# Altium schematic sheet Sheet1.SchDoc
size A4; SheetNumber: 1; SheetTotal: 1
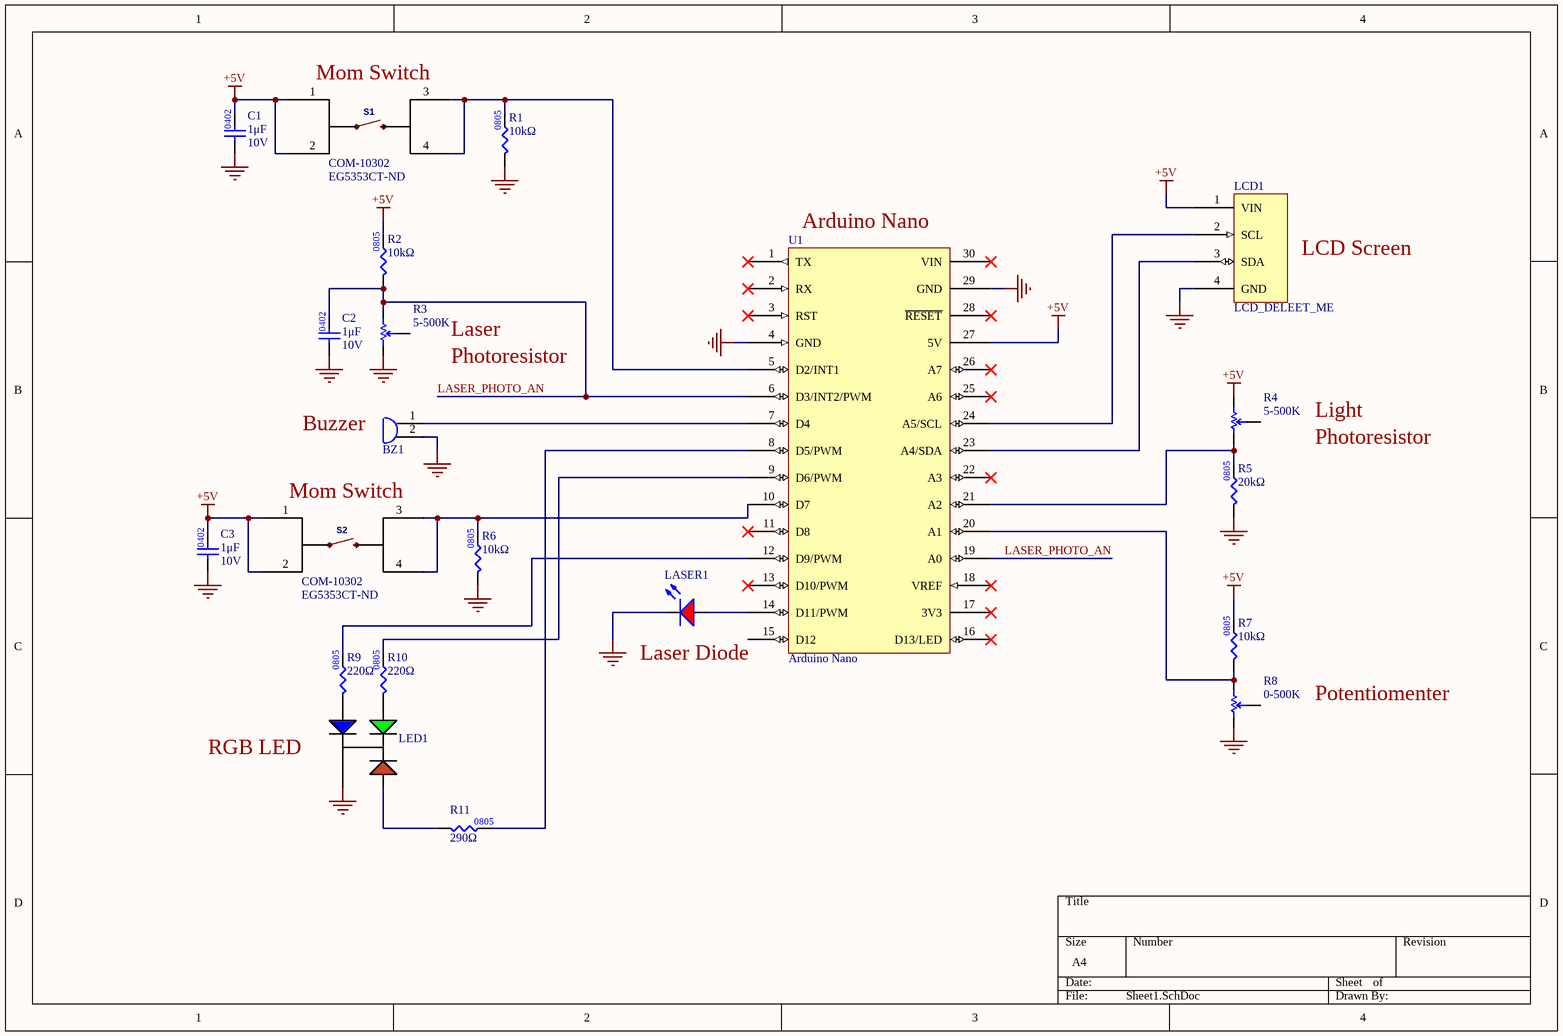
[diagram p0: Sheet1.SchDoc]

## Parts
BZ1  CMI-1275C-050  [CMI1275C050]  (value not drawn)
C1  Capacitance: 1μF  Rated DC Voltage (URdc): 10V  [CAP0402]  (hidden comment: CAP_1UF_10V_0402_X5R)
C2  Capacitance: 1μF  Rated DC Voltage (URdc): 10V  [CAP0402]  (hidden comment: CAP_1UF_10V_0402_X5R)
C3  Capacitance: 1μF  Rated DC Voltage (URdc): 10V  [CAP0402]  (hidden comment: CAP_1UF_10V_0402_X5R)
LASER1  LED_RED  [LED_0805_RED]  (value not drawn)
LCD1  LCD_DELEET_ME
LED1  LED_RGB_CA  [LED_RGB]  (value not drawn)
R1  value 10kΩ  [RES0805]  (hidden comment: RES_10kΩ_0805_5%)
R2  value 10kΩ  [RES0805]  (hidden comment: RES_10kΩ_0805_5%)
R3  value 5-500K  [3362P-1-502LF]  (hidden comment: POT_5K)
R4  value 5-500K  [3362P-1-502LF]  (hidden comment: POT_5K)
R5  value 20kΩ  [RES0805]  (hidden comment: RES_20kΩ_0805_1%)
R6  value 10kΩ  [RES0805]  (hidden comment: RES_10kΩ_0805_5%)
R7  value 10kΩ  [RES0805]  (hidden comment: RES_10kΩ_0805_5%)
R8  value 0-500K  [3362P-1-502LF]  (hidden comment: POT_5K)
R9  value 220Ω  [RES0805]  (hidden comment: RES_220Ω_0805_5%)
R10  value 220Ω  [RES0805]  (hidden comment: RES_220Ω_0805_5%)
R11  value 290Ω  [RES0805]  (hidden comment: RES_220Ω_0805_5%)
S1  Manufacturer Part Number 1: COM-10302  Supplier Part Number 2: EG5353CT-ND  [TACTILE_SWITCH_PTH_12MM]  (hidden comment: SW_MOMENTARY_PUSHBUTTON)
S2  Manufacturer Part Number 1: COM-10302  Supplier Part Number 2: EG5353CT-ND  [TACTILE_SWITCH_PTH_12MM]  (hidden comment: SW_MOMENTARY_PUSHBUTTON)
U1  Arduino Nano

## Nets
+5V: C1.2 C3.2 LCD1.1(VIN) R2.2 R4.2 R7.2 S1.1 S1.2 S2.1 S2.2 U1.27(5V)
GND: BZ1.2 C1.1 C2.1 C3.1 LASER1.2(K) LCD1.4(GND) LED1.4(COMMON_ANODE) R1.1 R3.1 R5.1 R6.1 R8.1 U1.4(GND) U1.29(GND)
LASER_PHOTO_AN: C2.2 R2.1 R3.2 U1.6(D3/INT2/PWM) U1.19(A0)
NetBZ1_1: BZ1.1 U1.7(D4)
NetLASER1_1: LASER1.1(A) U1.14(D11/PWM)
NetLCD1_2: LCD1.2(SCL) U1.24(A5/SCL)
NetLCD1_3: LCD1.3(SDA) U1.23(A4/SDA)
NetLED1_1: LED1.1(CATHODE_(RED)) R11.1
NetLED1_2: LED1.2(CATHODE_(GREEN)) R10.1
NetLED1_3: LED1.3(CATHODE_(BLUE)) R9.1
NetR1_2: R1.2 S1.3 S1.4 U1.5(D2/INT1)
NetR4_1: R4.1 R5.2 U1.21(A2)
NetR6_2: R6.2 S2.3 S2.4 U1.10(D7)
NetR7_1: R7.1 R8.2 U1.20(A1)
NetR9_2: R9.2 U1.12(D9/PWM)
NetR10_2: R10.2 U1.9(D6/PWM)
NetR11_2: R11.2 U1.8(D5/PWM)

Not connected (* = marked no-connect by the designer): R3 3; R4 3; R8 3; U1 1(TX)* 2(RX)* 3(RST)* 11(D8)* 13(D10/PWM)* 15(D12) 16(D13/LED)* 17(3V3)* 18(VREF)* 22(A3)* 25(A6)* 26(A7)* 28(~{RESET})* 30(VIN)*

## Notes on the sheet
- (near S1) Mom Switch
- (near U1) Arduino Nano
- LCD Screen
- Photoresistor
- Laser
- (near BZ1) Buzzer
- Light
- (near S2) Mom Switch
- Laser Diode
- Potentiomenter
- RGB LED

## Library data of the parts
BZ1 = CMI-1275C-050: Buzzer; Manufacturer 1: CUI Inc.; Datasheet Link: https://componentsearchengine.com/Datasheets/1/CMI-1275C-050.pdf; Height: 8mm; Manufacturer Part Number 1: CMI-1275C-050; Mouser Part Number: 490-CMI-1275C-050; Mouser Price/Stock: https://www.mouser.co.uk/ProductDetail/CUI-Devices/CMI-1275C-050?qs=qCxwlXJ4fnyWvfqXc%252BNqAA%3D%3D; Arrow Part Number: CMI-1275C-050; Arrow Price/Stock: https://www.arrow.com/en/products/cmi-1275c-050/cui-inc; Supplier 1: Digi-Key; Supplier Part Number 1: 668-1456-ND
C1-C3 = CAP_1UF_10V_0402_X5R: CAP CER 1UF 10V X5R 0402; Manufacturer: Kyocera AVX; Manufacturer Part Number: 0402ZD105MAT2A; Supplier 1: Digi-Key; Supplier Part Number 1: 478-5768-1-ND; Mounting Type: Surface Mount; Package: 0402; Temperature Characteristics Code: X5R; ComponentLink7URL: https://datasheet.ciiva.com/11531/cx5r-11531784.pdf?src-supplier=Avnet; ComponentLink7Description: https://datasheet.ciiva.com/11531/cx5r-11531784.pdf?src-supplier=Avnet
LASER1 = LED_RED: LED RED DIFFUSED 0805 SMD; Manufacturer 1: OSRAM; Manufacturer Part Number 1: LS R976-NR-1; Package/Footprint: 0805; Forward Voltage Drop: 2V; Supplier Part Number 1: 475-1278-1-ND; Supplier 1: Digi-Key; Mounting Type: SMD
LED1 = LED_RGB_CA: LED RGB DIFFUSED 4PLCC SMD; Manufacturer 1: Broadcom; Manufacturer Part Number 1: ASMB-MTB1-0A3A2; Color: Blue,Green,Red; Lens Color: White; Viewing Angle: 115°; Lens Style: Round; Luminous Intensity: 350mcd; Dominant Wavelength: 470nm; Forward Voltage: 3.1V; Test Current: 20mA; Package/Footprint: 4-PLCC; Supplier 1: Digi-Key; Mounting Type: SMD; Number of Pins: 4; Lens Transparency: Diffused; Supplier Part Number 1: 516-3280-1-ND
R1 R2 R6 R7 = RES_10kΩ_0805_5%: RES 10K OHM 5% 1/8W 0805; Manufacturer 1: Panasonic Electronic Components; Manufacturer Part Number 1: ERJ-6GEYJ103V; Package/Footprint: 0805; Supplier 1: Digi-Key; Supplier Part Number 1: P10KACT-ND; LCSC Part #: C17414; Mounting Type: SMD
R3 R4 R8 = POT_5K: TRIMMER 5K OHM 0.5W PC PIN TOP; Manufacturer 1: Bourns Inc.; Manufacturer Part Number 1: 3362P-1-502LF; Supplier Part Number 1: 3362P-502LF-ND; Supplier 1: Digi-Key
R5 = RES_20kΩ_0805_1%: RES 20K OHM 1% 1/8W 0805; Manufacturer 1: Yageo; Manufacturer Part Number 1: RC0805FR-0720KL; Package/Footprint: 0805; Supplier 1: Digi-Key; Mounting Type: SMD; Supplier Part Number 1: 311-20.0KCRCT-ND; LCSC Part #: C4328
R9-R11 = RES_220Ω_0805_5%: RES 220 OHM 5% 1/2W 0805; Manufacturer 1: Panasonic Electronic Components; Manufacturer Part Number 1: ERJ-P06J221V; Supplier Part Number 1: P220ADCT-ND; Supplier 1: Digi-Key; Mounting Type: SMD; LCSC Part #: C17557; Package: 0805
S1 S2 = SW_MOMENTARY_PUSHBUTTON: TL3305A Series SPST 12 V 4.5 x 4.5 mm 260 gf Top Actuated SMT Tactile Switch; Manufacturer 1: SparkFun; Manufacturer: E-Switch; Manufacturer Part Number: TL3305AF260QG; Package/Footprint: TH; Mechanical Life: 200000Cycles; Illumination Type: Non-Illuminated; Operating Force: 260gf; Switch Travel: 0.2mm; Switch Function: Off-Mom; Actuator Type: Standard; Supplier 1: Digi-Key; Mounting Type: TH; Supplier Part Number 1: 1568-1332-ND; Verified: No; Supplier 2: Digi-Key; RoHS: Yes; Category: Tactile Switches; Stock 2: 79505; Pricing 2: 1=0.21000, 10=0.20500, 25=0.19440, 100=0.17600, 250=0.16048, 500=0.14918, 1000=0.12726 (USD); Mount: Surface Mount; Min Operating Temperature: -20°C; Max Operating Temperature: 70°C; Packaging: Tape and Reel; Termination: Gull Wing; Throw Configuration: SPST; Lead Free: Lead Free; ComponentLink1URL: http://www.farnell.com/datasheets/2554191.pdf?src-supplier=Farnell; ComponentLink1Description: http://www.farnell.com/datasheets/2554191.pdf?src-supplier=Farnell; ComponentLink2URL: http://spec_sheets.e-switch.com/specs/P010471.pdf?src-supplier=Mouser; ComponentLink2Description: http://spec_sheets.e-switch.com/specs/P010471.pdf?src-supplier=Mouser; ComponentLink3URL: http://spec_sheets.e-switch.com/specs/P010471.pdf?src-supplier=Digi-Key; ComponentLink3Description: http://spec_sheets.e-switch.com/specs/P010471.pdf?src-supplier=Digi-Key; ComponentLink4URL: http://www.farnell.com/datasheets/2554191.pdf?src-supplier=Newark; ComponentLink4Description: http://www.farnell.com/datasheets/2554191.pdf?src-supplier=Newark; ComponentLink5URL: http://www.farnell.com/datasheets/2554191.pdf?src-supplier=Element14; ComponentLink5Description: http://www.farnell.com/datasheets/2554191.pdf?src-supplier=Element14; ComponentLink6URL: http://spec_sheets.e-switch.com/specs/P010471.pdf?src-supplier=NAC+Semi; ComponentLink6Description: http://spec_sheets.e-switch.com/specs/P010471.pdf?src-supplier=NAC+Semi
U1 = DELETE_ME